# Altium schematic sheet BRD9057A_SiWx917M_4-Layer_ExtSw_REF_DES_A01_Page_5.SchDoc: =TitlePage5
size A3; Organization: Altium Limited; Address1: L3, 12a Rodborough Rd; Address2: Frenchs Forest; Address3: NSW; Address4: Australia 2086; SheetNumber: 5; SheetTotal: 5
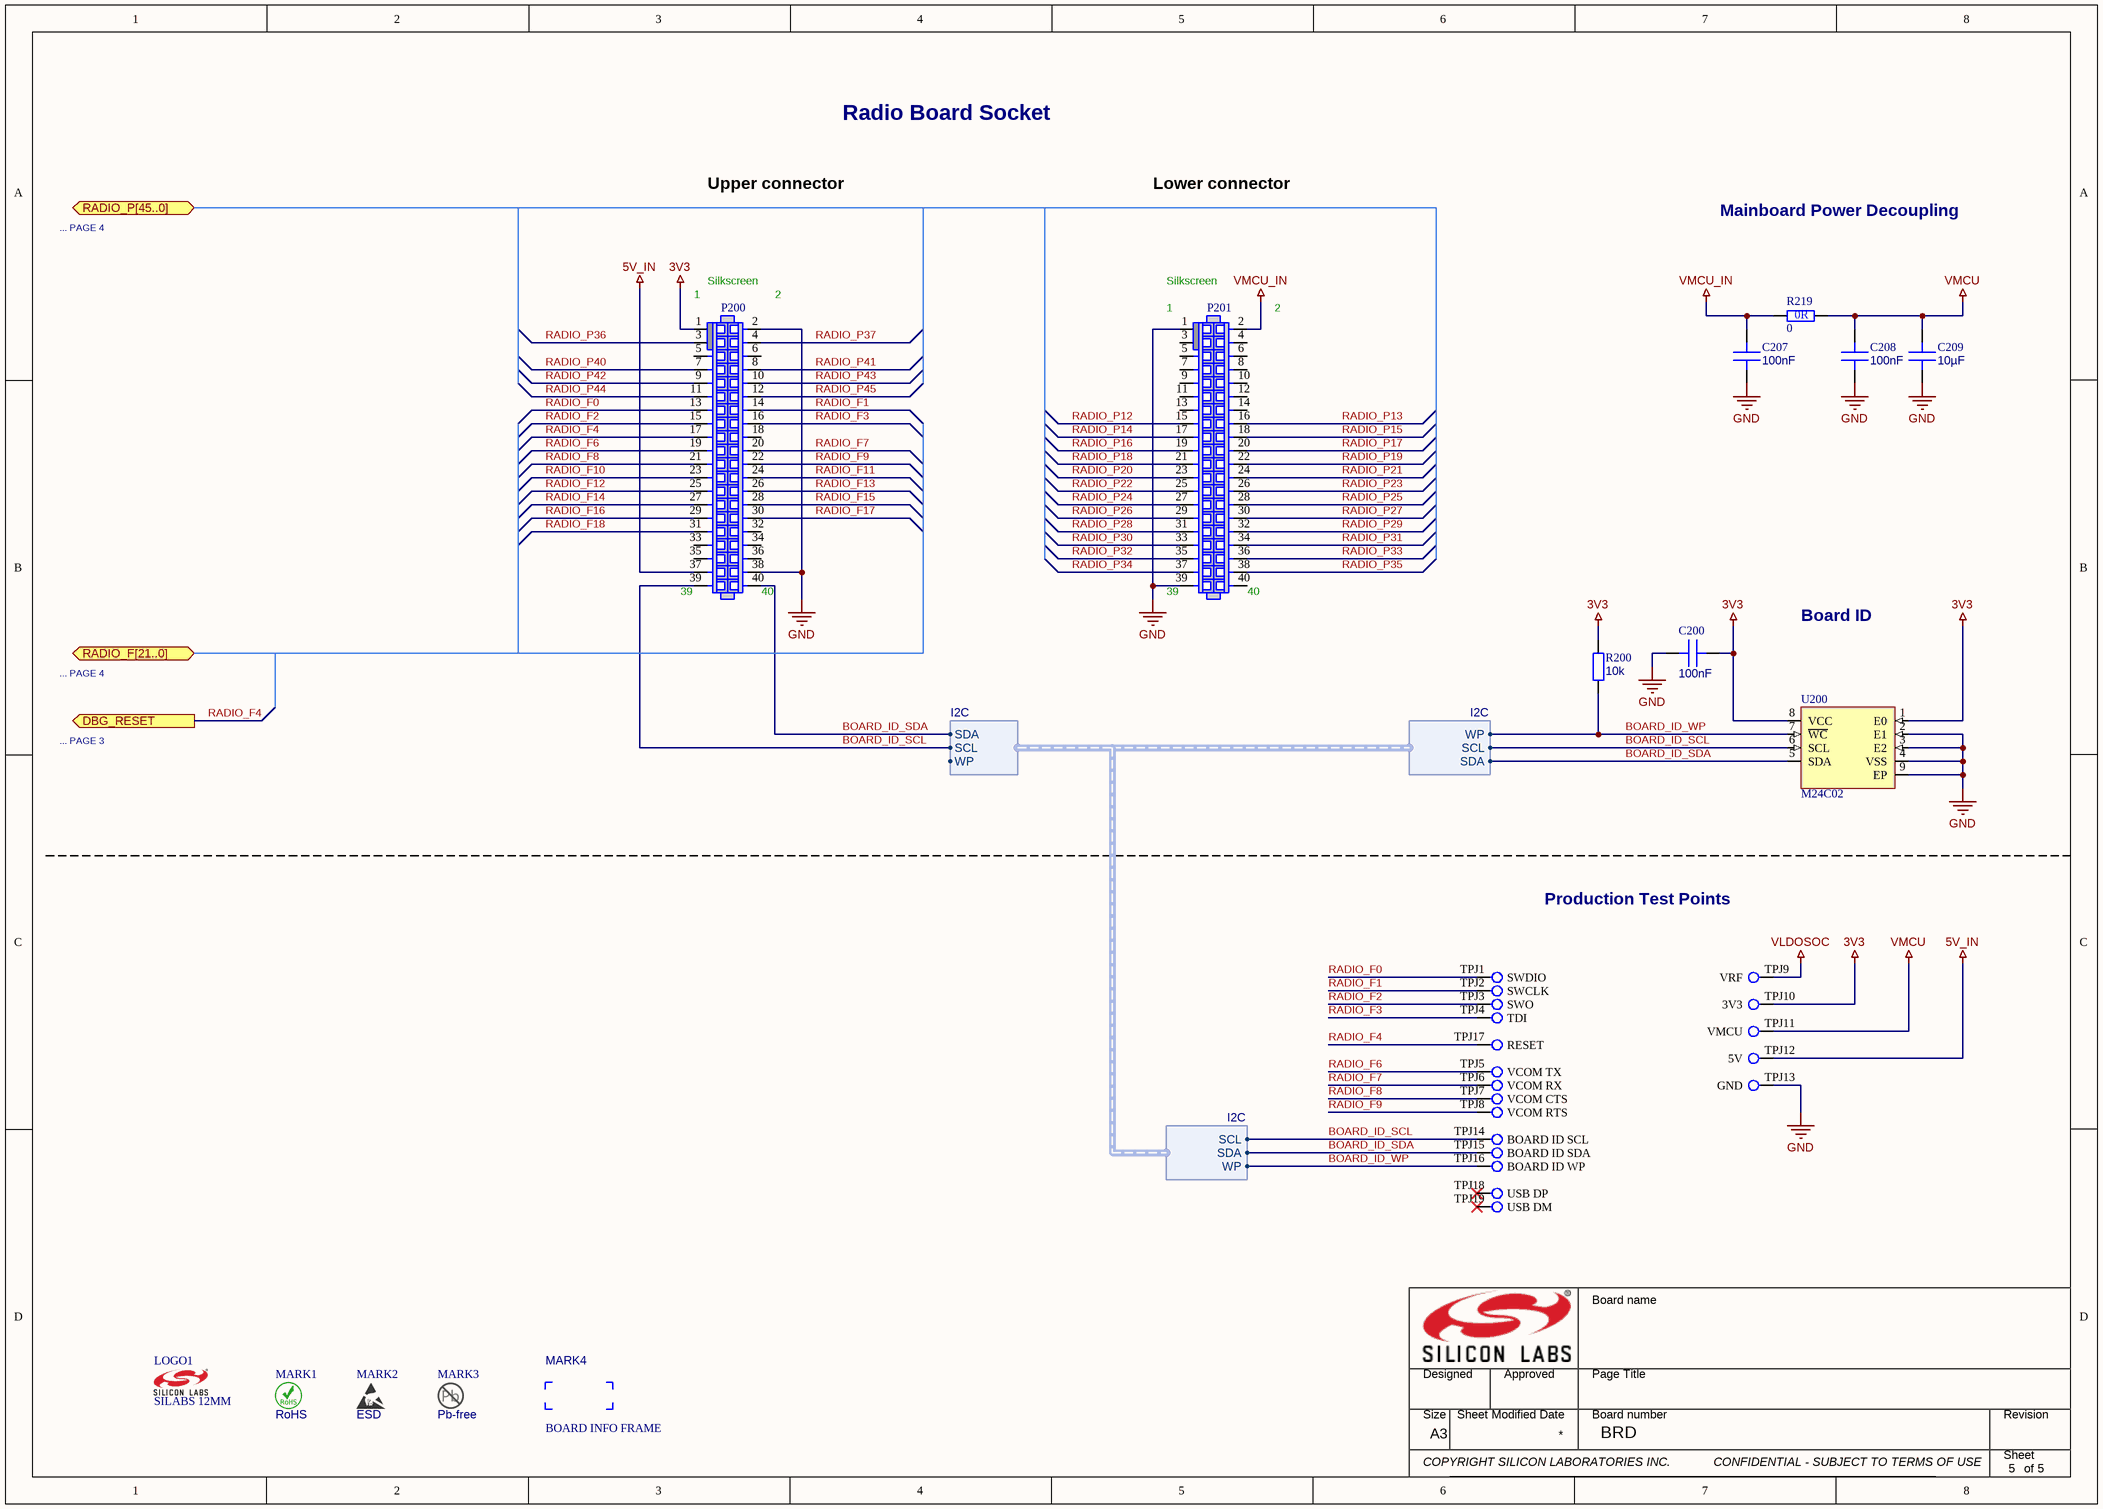
[diagram p0: BRD9057A_SiWx917M_4-Layer_ExtSw_REF_DES_A01_Page_5.SchDoc]

## Parts
C200  value 100nF  [C0201_GM]  (hidden comment: CAP CER 0201 X5R 100nF 16V 10%)
C207  value 100nF  [C0201_GM]  (hidden comment: CAP CER 0201 X5R 100nF 16V 10%)
C208  value 100nF  [C0201_GM]  (hidden comment: CAP CER 0201 X5R 100nF 16V 10%)
C209  value 10µF  [C0603]  (hidden comment: CAP CER 0603 X5R 10uF 16V 10%)
LOGO1  value SILABS 12MM  [LOGO_SILABS_W12.0_SILK]  (hidden comment: LOGO SILABS 12MM)  (no BOM)
M1  RB TEST FIXTURE PATTERN  [RB TEST FIXTURE PATTERN]  (value not drawn)  (no BOM)
MARK1  value RoHS  [LOGO RoHS 5MM]  (hidden comment: LOGO RoHS 5MM)  (no BOM)
MARK2  value ESD  [LOGO ESD 4.5MM]  (hidden comment: LOGO ESD 4.5MM)  (no BOM)
MARK3  value Pb-free  [LOGO PBF 2MM]  (hidden comment: LOGO PBF 2MM)  (no BOM)
MARK4  value BOARD INFO FRAME  [BOARD INFO FRAME SILK-Footprint-1]  (hidden comment: BOARD INFO FRAME 19MM)  (no BOM)
P200  2344-220MS3CUNR8  [SAMTEC_SFC-120-T2-L-D-A]  (value not drawn)
P201  2344-220MS3CUNR8  [SAMTEC_SFC-120-T2-L-D-A]  (value not drawn)
R200  value 10k  [R0201]  (hidden comment: RES 0201 10K 1/20W 1% 200ppm)
R219  value 0  [R0402]  (hidden comment: RES 0402 0R)
U200  value M24C02  [DFN50P300X200X60_HS-9N_GM]  (hidden comment: M24C02-FMC6TG)

## Ports
DBG_RESET (out), RADIO_F[21..0] (bidir), RADIO_P[45..0] (bidir, harness I2C)

## Harnesses
I2C: SCL, SDA, WP
I2C: SCL, WP, SDA

## Nets
3V3: C200.1 M1.TPJ10(3V3) P200.1 R200.2 U200.1(E0) U200.8(VCC)
5V_IN: M1.TPJ12(5V) P200.37
GND: C200.2 C207.1 C208.1 C209.2 M1.TPJ13(GND) P200.2 P200.38 P201.1 P201.39 U200.2(E1) U200.3(E2) U200.4(VSS) U200.9(EP)
VLDOSOC: M1.TPJ9(VRF)
VMCU: C208.2 C209.1 M1.TPJ11(VMCU) R219.2
VMCU_IN: C207.2 P201.2 R219.1
BOARD_ID_SCL: M1.TPJ14(BOARD_ID_SCL) P200.39 U200.6(SCL) ; harness I2C.SCL
BOARD_ID_SDA: M1.TPJ15(BOARD_ID_SDA) P200.40 U200.5(SDA) ; harness I2C.SDA
BOARD_ID_WP: M1.TPJ16(BOARD_ID_WP) R200.1 U200.7(~{WC}) ; harness I2C.WP
RADIO_F0: M1.TPJ1(SWDIO) P200.13
RADIO_F1: M1.TPJ2(SWCLK) P200.14
RADIO_F2: M1.TPJ3(SWO) P200.15
RADIO_F3: M1.TPJ4(TDI) P200.16
RADIO_F4: M1.TPJ17(RESET) P200.17 ; port DBG_RESET
RADIO_F6: M1.TPJ5(VCOM_TX) P200.19
RADIO_F7: M1.TPJ6(VCOM_RX) P200.20
RADIO_F8: M1.TPJ7(VCOM_CTS) P200.21
RADIO_F9: M1.TPJ8(VCOM_RTS) P200.22
RADIO_F10: P200.23
RADIO_F11: P200.24
RADIO_F12: P200.25
RADIO_F13: P200.26
RADIO_F14: P200.27
RADIO_F15: P200.28
RADIO_F16: P200.29
RADIO_F17: P200.30
RADIO_F18: P200.31
RADIO_P12: P201.15
RADIO_P13: P201.16
RADIO_P14: P201.17
RADIO_P15: P201.18
RADIO_P16: P201.19
RADIO_P17: P201.20
RADIO_P18: P201.21
RADIO_P19: P201.22
RADIO_P20: P201.23
RADIO_P21: P201.24
RADIO_P22: P201.25
RADIO_P23: P201.26
RADIO_P24: P201.27
RADIO_P25: P201.28
RADIO_P26: P201.29
RADIO_P27: P201.30
RADIO_P28: P201.31
RADIO_P29: P201.32
RADIO_P30: P201.33
RADIO_P31: P201.34
RADIO_P32: P201.35
RADIO_P33: P201.36
RADIO_P34: P201.37
RADIO_P35: P201.38
RADIO_P36: P200.3
RADIO_P37: P200.4
RADIO_P40: P200.7
RADIO_P41: P200.8
RADIO_P42: P200.9
RADIO_P43: P200.10
RADIO_P44: P200.11
RADIO_P45: P200.12

Not connected (* = marked no-connect by the designer): M1 TPJ18(USB_DP)* TPJ19(USB_DM)*; P200 5 6 18 32 33 34 35 36; P201 3 4 5 6 7 8 9 10 11 12 13 14 40

## Notes on the sheet
- Radio Board Socket
- ... PAGE 4
- Upper connector
- Lower connector
- Mainboard Power Decoupling
- (near P200) 1
- (near P200) Silkscreen
- (near P200) 2
- (near P201) Silkscreen
- (near P201) 1
- (near P201) 2
- (near P200) 39
- (near P200) 40
- (near P201) 39
- (near P201) 40
- Board ID
- ... PAGE 3
- Production Test Points
- Board name
- Designed
- Approved
- Page Title
- Size
- A3
- Sheet Modified Date
- Board number
- BRD
- Revision
- Sheet
- COPYRIGHT SILICON LABORATORIES INC.
- CONFIDENTIAL - SUBJECT TO TERMS OF USE
- of
- (in symbol CMP-180-00061-B.02) 0R

## Library data of the parts
C200 C207 C208 = CMP-120-00007-B.06: SubCategory Tag: Ceramic; Material: X5R; Max Operating Temp: 85°C; Rating: 16V; Package: 0201; Mount: SMD; RoHS: Compliant; Min Operating Temp: -55°C; Tolerance: 10%
C209 = CMP-120-00151-A.01: SubCategory Tag: Ceramic; Tolerance: 10%; RoHS: Compliant; Min Operating Temp: -55°C; Material: X5R; Package: 0603; Mount: SMD; Max Operating Temp: 85°C; Rating: 16V
LOGO1 = CMP-000-00112-A.01: Silkscreen logo, Silabs logo and text, B: 12MM, H:6MM; Additional Search Tag: Surface; SubCategory Tag: GRAPH; Mount: N/A
M1 = CMP-000-00032-A.04: Subset of testpoints and keepouts for production test of Radio Boards; SubCategory Tag: TP; Additional Search Tag: Surface; Value: TEST FIXTURE PATTERN; Mount: N/A
MARK1 = CMP-000-00011-A.03: Silkscreen logo, RoHS, 5MM; Additional Search Tag: Surface; SubCategory Tag: GRAPH; Mount: N/A
MARK2 = CMP-000-00009-A.07: Silkscreen logo, ESD, 4.5MM; SubCategory Tag: GRAPH; Additional Search Tag: Surface; Mount: N/A
MARK3 = CMP-000-00010-A.06: Silkscreen logo, lead free, 2MM; Additional Search Tag: Surface; SubCategory Tag: GRAPH; Mount: N/A
MARK4 = CMP-000-00021-A.03: Board info frame 19MM x 6MM, Silkscreen; SubCategory Tag: GRAPH; Additional Search Tag: Surface; Mount: N/A
P200 P201 = CMP-125-00164-A.12: SOCKET 2X20 1.27MM SMD VRT KEYED; Manufacturer: WCON; Additional Search Tag: Female; Note: Samtec footprint made as default as used for radio boards; SubCategory Tag: Header 1.27mm; No of Rows: 2; No of Positions: 40; Max Operating Temp: 105°C; Manufacturer PN: 2344-220MS3CUNR8; Min Operating Temp: -40°C; Package: HDR 2X20 1.27MM; Mount: SMD; RoHS: Compliant; Value: 2344-220MS3CUNR8
R200 = CMP-180-00002-A.10: SubCategory Tag: Thick Film; Rating: 50mW; Max Operating Temp: 125°C; Mount: SMD; Tolerance: 1%; Package: 0201; Min Operating Temp: -55°C; RoHS: Compliant
R219 = CMP-180-00061-B.02: Rating: 62.5mW; SubCategory Tag: Thick Film; Tolerance: 0%; Min Operating Temp: -55°C; Max Operating Temp: 155°C; RoHS: Compliant; Package: 0402; Mount: SMD
U200 = CMP-150-00051-B.01: IC EEPROM 2KBIT I2C UFDFPN8; Manufacturer: ST Microelectronics; Voltage: 5.5V; SubCategory Tag: Memory; Additional Search Tag: EEPROM; Mount: SMD; Min Operating Temp: -40°C; Package: UFDFPN8; Max Operating Temp: 85°C; Manufacturer PN: M24C02-FMC6TG; RoHS: Compliant